# Altium project PCB_Project1.PrjPCB
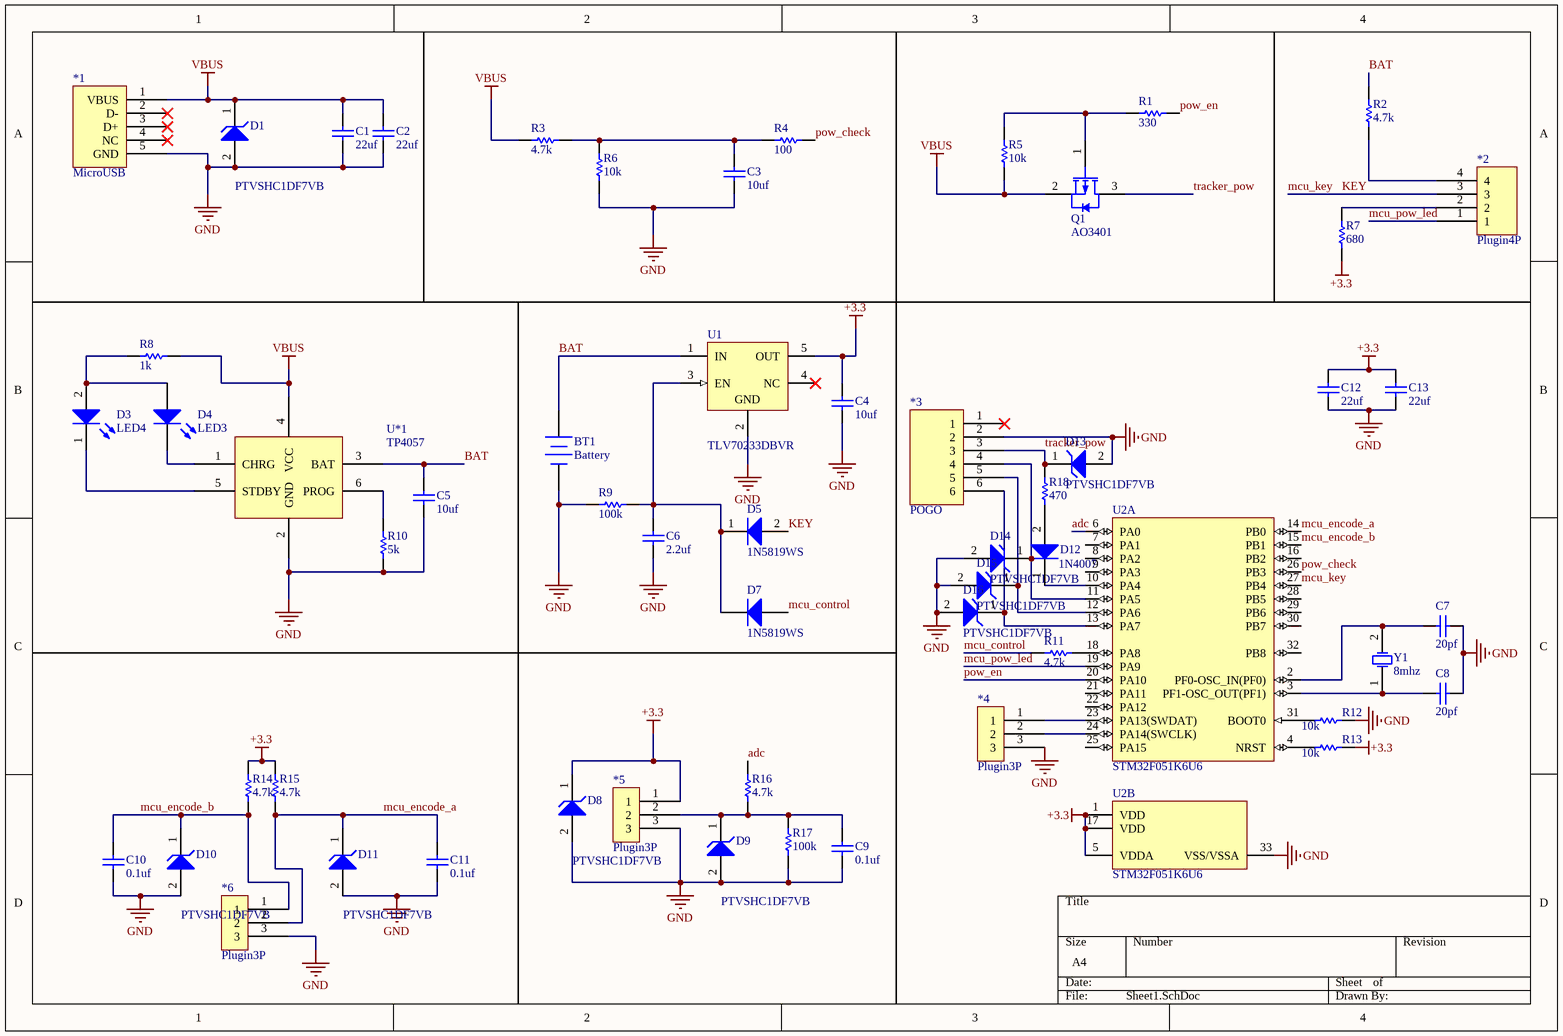
[diagram p0: Sheet1.SchDoc]
1 sheet, 57 parts. Net scope: global (net labels, ports and power ports of the same name join across sheets).
Board file: PCB1.PcbDoc

## Sheet Sheet1.SchDoc
size A4

### Parts
*1  MicroUSB  [MicroUSB]
*2  Plugin4P  [PLUGIN4P]
*3  POGO  [POGO]
*4  Plugin3P  [Plugin3P]
*5  Plugin3P  [Plugin3P]
*6  Plugin3P  [Plugin3P]
BT1  Battery  [BAT-2]
C1  22uf  [RESC2013X65X40LL15T20]
C2  22uf  [RESC2013X65X40LL15T20]
C3  10uf  [RESC2013X65X40LL15T20]
C4  10uf  [RESC2013X65X40LL15T20]
C5  10uf  [RESC2013X65X40LL15T20]
C6  2.2uf  [RESC2013X65X40LL15T20]
C7  20pf  [RESC2013X65X40LL15T20]
C8  20pf  [RESC2013X65X40LL15T20]
C9  0.1uf  [RESC2013X65X40LL15T20]
C10  0.1uf  [RESC2013X65X40LL15T20]
C11  0.1uf  [RESC2013X65X40LL15T20]
C12  22uf  [RESC2013X65X40LL15T20]
C13  22uf  [RESC2013X65X40LL15T20]
D1  PTVSHC1DF7VB  [ONSC-SOD-123-2-425-04_V]
D3  LED4  [RESC2013X65X40LL15T20]
D4  LED3  [RESC2013X65X40LL15T20]
D5  1N5819WS  [ONSC-SOD-323-2-477-02_V]
D7  1N5819WS  [ONSC-SOD-323-2-477-02_V]
D8  PTVSHC1DF7VB  [ONSC-SOD-123-2-425-04_V]
D9  PTVSHC1DF7VB  [ONSC-SOD-123-2-425-04_V]
D10  PTVSHC1DF7VB  [ONSC-SOD-123-2-425-04_V]
D11  PTVSHC1DF7VB  [ONSC-SOD-123-2-425-04_V]
D12  1N4007  [ONSC-SOD-323-2-477-02_V]
D13  PTVSHC1DF7VB  [ONSC-SOD-123-2-425-04_V]
D14  PTVSHC1DF7VB  [ONSC-SOD-123-2-425-04_V]
D15  PTVSHC1DF7VB  [ONSC-SOD-123-2-425-04_V]
D16  PTVSHC1DF7VB  [ONSC-SOD-123-2-425-04_V]
Q1  AO3401  [INF-PG-SOT23_N]
R1  330  [RESC2013X65X40LL15T20]
R2  4.7k  [RESC2013X65X40LL15T20]
R3  4.7k  [RESC2013X65X40LL15T20]
R4  100  [RESC2013X65X40LL15T20]
R5  10k  [RESC2013X65X40LL15T20]
R6  10k  [RESC2013X65X40LL15T20]
R7  680  [RESC2013X65X40LL15T20]
R8  1k  [RESC2013X65X40LL15T20]
R9  100k  [RESC2013X65X40LL15T20]
R10  5k  [RESC2013X65X40LL15T20]
R11  4.7k  [RESC2013X65X40LL15T20]
R12  10k  [RESC2013X65X40LL15T20]
R13  10k  [RESC2013X65X40LL15T20]
R14  4.7k  [RESC2013X65X40LL15T20]
R15  4.7k  [RESC2013X65X40LL15T20]
R16  4.7k  [RESC2013X65X40LL15T20]
R17  100k  [RESC2013X65X40LL15T20]
R18  470  [RESC2013X65X40LL15T20]
U1  TLV70233DBVR  [TI-DBV5_N]
U2  STM32F051K6U6  [STM-UFQFPN32_N]  (parts A,B of 2)
U*1  TP4057  [TP4057]
Y1  8mhz  [XTAL]

### Nets
+3.3: *5.1 C4.2 C12.2 C13.2 D8.1(K) R7.2 R13.2 R14.2 R15.2 U1.5(OUT) U2.1(VDD) U2.5(VDDA) U2.17(VDD)
GND: *1.5(GND) *3.2 *4.3 *5.3 *6.3 BT1.2(-) C1.1 C2.1 C3.1 C4.1 C5.1 C6.1 C7.1 C8.1 C9.2 C10.2 C11.2 C12.1 C13.1 D1.2(A) D8.2(A) D9.2(A) D10.2(A) D11.2(A) D13.2(A) D14.2(A) D15.2(A) D16.2(A) R6.1 R9.2 R10.1 R12.2 R17.1 U1.2(GND) U2.33(VSS/VSSA) U*1.2(GND)
VBUS: *1.1(VBUS) C1.2 C2.2 D1.1(K) Q1.2(SOURCE) R3.1 R5.1 R8.2 U*1.4(VCC)
adc: R16.2 U2.6(PA0)
BAT: BT1.1(+) C5.2 R2.2 U1.1(IN) U*1.3(BAT)
KEY: *2.3 D5.2(A) U2.27(PB4)  [also labelled mcu_key]
mcu_control: D7.2(A) R11.1
mcu_encode_a: *6.2 C11.1 D11.1(K) R15.1 U2.14(PB0)
mcu_encode_b: *6.1 C10.1 D10.1(K) R14.1 U2.15(PB1)
mcu_pow_led: *2.1 U2.19(PA9)
pow_check: R4.2 U2.26(PB3)
pow_en: R1.2 U2.20(PA10)
tracker_pow: *3.3 D13.1(K) Q1.3(DRAIN) R18.2
Net*2_2: *2.2 R7.1
Net*2_4: *2.4 R2.1
Net*3_4: *3.4 D14.1(K) U2.11(PA5)
Net*3_5: *3.5 D15.1(K) U2.12(PA6)
Net*3_6: *3.6 D16.1(K) U2.13(PA7)
Net*4_1: *4.1 U2.23(PA13(SWDAT))
Net*4_2: *4.2 U2.24(PA14(SWCLK))
Net*5_2: *5.2 C9.1 D9.1(K) R16.1 R17.2
NetC3_2: C3.2 R3.2 R4.1 R6.2
NetC6_2: C6.2 D5.1(K) D7.1(K) R9.1 U1.3(EN)
NetC7_2: C7.2 U2.2(PF0-OSC_IN(PF0)) Y1.2(OSC2)
NetC8_2: C8.2 U2.3(PF1-OSC_OUT(PF1)) Y1.1(OSC1)
NetD3_1: D3.1(K) U*1.5(STDBY)
NetD3_2: D3.2(A) D4.2(A) R8.1
NetD4_1: D4.1(K) U*1.1(CHRG)
NetD12_1: D12.1(K) U2.10(PA4)
NetD12_2: D12.2(A) R18.1
NetQ1_1: Q1.1(GATE) R1.1 R5.2
NetR10_2: R10.2 U*1.6(PROG)
NetR11_2: R11.2 U2.18(PA8)
NetR12_1: R12.1 U2.31(BOOT0)
NetR13_1: R13.1 U2.4(NRST)

Not connected (* = marked no-connect by the designer): *1 2(D-)* 3(D+)* 4(NC)*; *3 1*; U1 4(NC)*; U2 7(PA1) 8(PA2) 9(PA3) 16(PB2) 21(PA11) 22(PA12) 25(PA15) 28(PB5) 29(PB6) 30(PB7) 32(PB8)

### Library data of the parts
BT1 = Battery: Multicell Battery; Published: 24-Mar-1999; LatestRevisionDate: 17-Jul-2002; LatestRevisionNote: Re-released for DXP Platform.; PackageReference: BAT-2; Publisher: Altium Limited
C1 C2 C4-C13 = Cap: Capacitor; Value: 100uf; Published: 8-Jun-2000; LatestRevisionDate: 17-Jul-2002; LatestRevisionNote: Re-released for DXP Platform.; PackageReference: RAD-0.3; Publisher: Altium Limited
C3 = Cap: Capacitor; Published: 8-Jun-2000; LatestRevisionDate: 17-Jul-2002; LatestRevisionNote: Re-released for DXP Platform.; PackageReference: RAD-0.3; Publisher: Altium Limited; Value: 10uf
D1 D8-D11 D13-D16 = MMSZ39T1G: Zener Voltage Regulator, 500 mW, 2-Pin SOD-123, Pb-Free, Tape and Reel; Manufacturer: On Semiconductor; P Max (W): 0.5; DatasheetVersion: Rev. 11; PackageVersion: Rev. G, 10/2009; PackageReference: SOD-123-2-425-04; PackageDescription: 2-Pin SOD, Body 1.6 x 2.69 mm; Supplier 1: Digi-Key; Supplier Part Number 1: MMSZ39T1GOSTR-ND; Supplier 2: Digi-Key; Supplier Part Number 2: MMSZ39T1GOSCT-ND; Supplier 3: Digi-Key; Supplier Part Number 3: MMSZ39T1GOSDKR-ND; Supplier 4: Farnell; Supplier Part Number 4: 1887086; Supplier 5: Newark; Supplier Part Number 5: 09R9479; Supplier 6: Newark; Supplier Part Number 6: 26K4570; Supplier 7: Mouser; Supplier Part Number 7: 863-MMSZ39T1G; Packing: Tape and Reel; RoHS: Pb-Free; Mounting Technology: Surface Mount; PartNumber: MMSZ39T1G; ComponentLink1Description: Manufacturer URL; ComponentLink1URL: http://www.onsemi.com/; ComponentLink2Description: Datasheet; ComponentLink2URL: http://www.onsemi.com/pub_link/Collateral/MMSZ2V4T1-D.PDF; ComponentLink3Description: Package Specification; ComponentLink3URL: http://www.onsemi.com/pub_link/Collateral/425-04.PDF
D3 D4 = LED3: Typical BLUE SiC LED; Published: 8-Jun-2000; LatestRevisionDate: 17-Dec-2003; LatestRevisionNote: PCB Footprint replaced.; DatasheetVersion: 16-Apr-2002; PackageVersion: 16-Apr-2002; PackageReference: 3.5X2.8X1.9; Publisher: Altium Limited
D5 D7 D12 = Diode 1N5402: 3 Amp General Purpose Rectifier; Published: 8-Jun-2000; LatestRevisionDate: 17-Jul-2002; LatestRevisionNote: Re-released for DXP Platform.; DatasheetVersion: 1998; PackageVersion: Aug-1999; PackageReference: DO-201AD; Publisher: Altium Limited; ComponentLink1Description: Manufacturer Link; ComponentLink1URL: http://www.fairchildsemi.com/; ComponentLink2Description: Datasheet; ComponentLink2URL: http://www.fairchildsemi.com/ds/1N%2F1N5400.pdf
Q1 = BSS215P H6327: P-Channel OptiMOS P2 Small-Signal-Transistor, -20 V VDS, -1.5 A ID, -55 to 150 degC, PG-SOT23, Reel, Green; Manufacturer: Infineon; Green: TRUE; ID (max): -1.5 A; IDpuls (max): -6 A; Pto t (max): 0.5 W; QG: -3.6 nC; RDS (on) (max): 280 mOhm; RDS (on) (max) (@4.5V): 150 mOhm; Rth: 250 K/W; VDS (max): -20 V; VGS(th) (max): -0.6 V; VGS(th) (min): -1.2 V; DatasheetVersion: Rev. 2.3; PackageVersion: Apr-08; PackageReference: PG-SOT23; PackageDescription: 3-Pin Small Outline Transistor Package, 2.9 x 1.3 mm Body, 0.95 mm Pitch; Supplier 1: Digi-Key; Supplier Part Number 1: BSS215P H6327TR-ND; Supplier 2: Digi-Key; Supplier Part Number 2: BSS215P H6327CT-ND; Supplier 3: Digi-Key; Supplier Part Number 3: BSS215P H6327DKR-ND; Halogen-free: TRUE; Packing: Reel; RDS (on) (max) (@2.5V): 280 mOhm; Mounting Technology: Surface Mount; PartNumber: BSS215P H6327; ComponentLink1Description: Manufacturer URL; ComponentLink1URL: http://www.infineon.com/; ComponentLink2Description: Datasheet; ComponentLink2URL: http://www.infineon.com/dgdl/BSS215P_Rev2.3.pdf?folderId=db3a304314dca38901154a72e3951a65&fileId=db3a304330f6860601311833f57144fb; ComponentLink3Description: Package Specification; ComponentLink3URL: http://www.infineon.com/dgdl/SOT23-Package_Overview.pdf?folderId=db3a30431936bc4b0119532290053c66&fileId=db3a30431936bc4b0119533468123c85
R1-R18 = CRG0805ZR: Chip Resistor, 0 Ohm, 0.125 W, -55 to 125 degC, 0805 (2012 Metric), RoHS, Tape and Reel; Part # Aliases: 1623401-1; Brand: TE Connectivity / Neohm; Unit Weight: 0.000194 oz; Resistance: 0 Ohms; DatasheetVersion: Rev. BA; PackageReference: SMD; PackageDescription: 2-Pin Surface Mount Device, Body 2 x 1.25 mm; Supplier 1: Newark; Supplier Part Number 1: 45P3014; Supplier 2: Digi-Key; Supplier Part Number 2: A106066TR-ND; Supplier 3: Digi-Key; Supplier Part Number 3: A106066CT-ND; Supplier 4: Digi-Key; Supplier Part Number 4: A106066DKR-ND; Product Category: Thick Film Resistors; Height: 0.55 mm; Length: 2 mm; Operating Temperature Range: - 55 C to + 125 C; Packaging: Reel; Product: Thick Film Resistors Zero-Ohm; Case Code - mm: 2012; Factory Pack Quantity: 5000; RoHS: True; Series: CRG; Case Code - in: 0805; Type: Thick Film Chip Resistors; Termination Style: SMD/SMT; Package / Case: 0805 (2012 metric); Width: 1.25 mm; ComponentLink1Description: Manufacturer URL; ComponentLink1URL: http://www.te.com; ComponentLink2Description: Datasheet; ComponentLink2URL: www.te.com/commerce/DocumentDelivery/DDEController?Action=showdoc&DocId=Customer+Drawing%7F1623401%7FBA%7Fpdf%7FEnglish%7FENG_CD_1623401_BA.pdf%7F1623401-1
U1 = TLV70233DBVR: Single Output LDO, 300 mA, Fixed 3.3 V Output, 2 to 5.5 V Input, with Low IQ, 5-pin SOT-23 (DBV), -40 to 125 degC, Green (RoHS & no Sb/Br); Manufacturer: Texas Instruments; Accuracy(%): 2; Fixed Output Options(V): 3.3; Iout(Max)(A): 0.3; Iq(Typ)(mA): 0.03; SubFamily: Single Channel LDO; Vdo(Typ)(mV): 220; Vin(Max)(V): 5.5; DatasheetVersion: SLVSAG6B; PackageVersion: 4073253-4/K; PackageReference: DBV5; PackageDescription: 5-Pin Plastic Small Outline, Body 1.60 脳 2.90 mm, Pitch 0.95 mm; Supplier 1: Digi-Key; Supplier Part Number 1: 296-32415-2-ND; Supplier 2: Digi-Key; Supplier Part Number 2: 296-32415-1-ND; Supplier 3: Digi-Key; Supplier Part Number 3: 296-32415-6-ND; Supplier 4: Newark; Supplier Part Number 4: 13T5909; Supplier 5: Mouser; Supplier Part Number 5: 595-TLV70233DBVR; Eco-Plan: Green (RoHS & no Sb/Br); Vin(Min)(V): 2; Vout Adj(Max)(V): 3.3; Vout Adj(Min)(V): 3.3; Mounting Technology: Surface Mount; Code_JEDEC: MO-178; PartNumber: TLV70233DBVR; ComponentLink1Description: Manufacturer URL; ComponentLink1URL: http://www.ti.com/; ComponentLink2Description: Datasheet; ComponentLink2URL: http://www.ti.com/general/docs/lit/getliterature.tsp?genericPartNumber=TLV70233&fileType=pdf; ComponentLink3Description: Package Specification; ComponentLink3URL: http://www.ti.com/litv/pdf/mpds018i
U2 = STM32F051K6U6: ARM Cortex-M0 32-bit MCU, 32 KB Flash, 4 KB Internal RAM, 27 I/Os, 32-pin UFQFPN, -40 to 85 degC, Tray; FLASH Size (Prog) (kB): 32; I/Os (High Current): 27; Internal RAM Size (kB): 4; Operating Frequency(F) (Processor speed) (MHz): 48; Supply Voltage(Vcc) min (V): 2; DatasheetVersion: Rev. 3; PackageVersion: Rev. 3, 07/2012; PackageReference: UFQFPN32; PackageDescription: 32-Pin Ultra Thin Fine Pitch Quad Flat No-Lead, 5 x 5 x 0.6 mm Body, 0.5 mm Pitch, Exposed Pad; Supplier 1: Digi-Key; Supplier Part Number 1: 497-12950-ND; Supplier 2: Newark; Supplier Part Number 2: 05W5804; Supplier 3: Mouser; Supplier Part Number 3: 511-STM32F051K6U6; Core: ARM Cortex-M0; Packing: Tray; Mounting Technology: Surface Mount; PartNumber: STM32F051K6U6; ComponentLink1Description: Manufacturer URL; ComponentLink1URL: http://www.st.com/web/en/home.html; ComponentLink2Description: Datasheet; ComponentLink2URL: http://www.st.com/st-web-ui/static/active/en/resource/technical/document/datasheet/DM00039193.pdf; ComponentLink3Description: Package Specification; ComponentLink3URL: http://www.st.com/st-web-ui/static/active/en/resource/technical/document/datasheet/DM00039193.pdf
Y1 = XTAL: Crystal Oscillator; Published: 8-Jun-2000; LatestRevisionDate: 17-Jul-2002; LatestRevisionNote: Re-released for DXP Platform.; PackageReference: R38; Publisher: Altium Limited